# Altium schematic sheet PowerSupply4ClkMezzanine.SchDoc: =ProjectName
size 420 x 297 mm; Author: SBH; CompanyName: WUT; DrawnBy: SBH; Organization: ISE-WUT; Address1: Warsaw Univeristy of Technology; Address2: Nowowiejska 15/19; DocumentNumber: 12; Revision: -; SheetNumber: 12; SheetTotal: 12; EDA_Number: ARTIQ; Projet: eRTM15 Baikal; ModifiedBy: -; CreateDate: XX/XX/XXXX; CheckedDate: -; Title2: PowerSupply4ClkMezzanine.SchDoc; DivGrp: ISE; Designer: SBH; ModifiedDate: -; ProjectName: eRTM15 Baikal
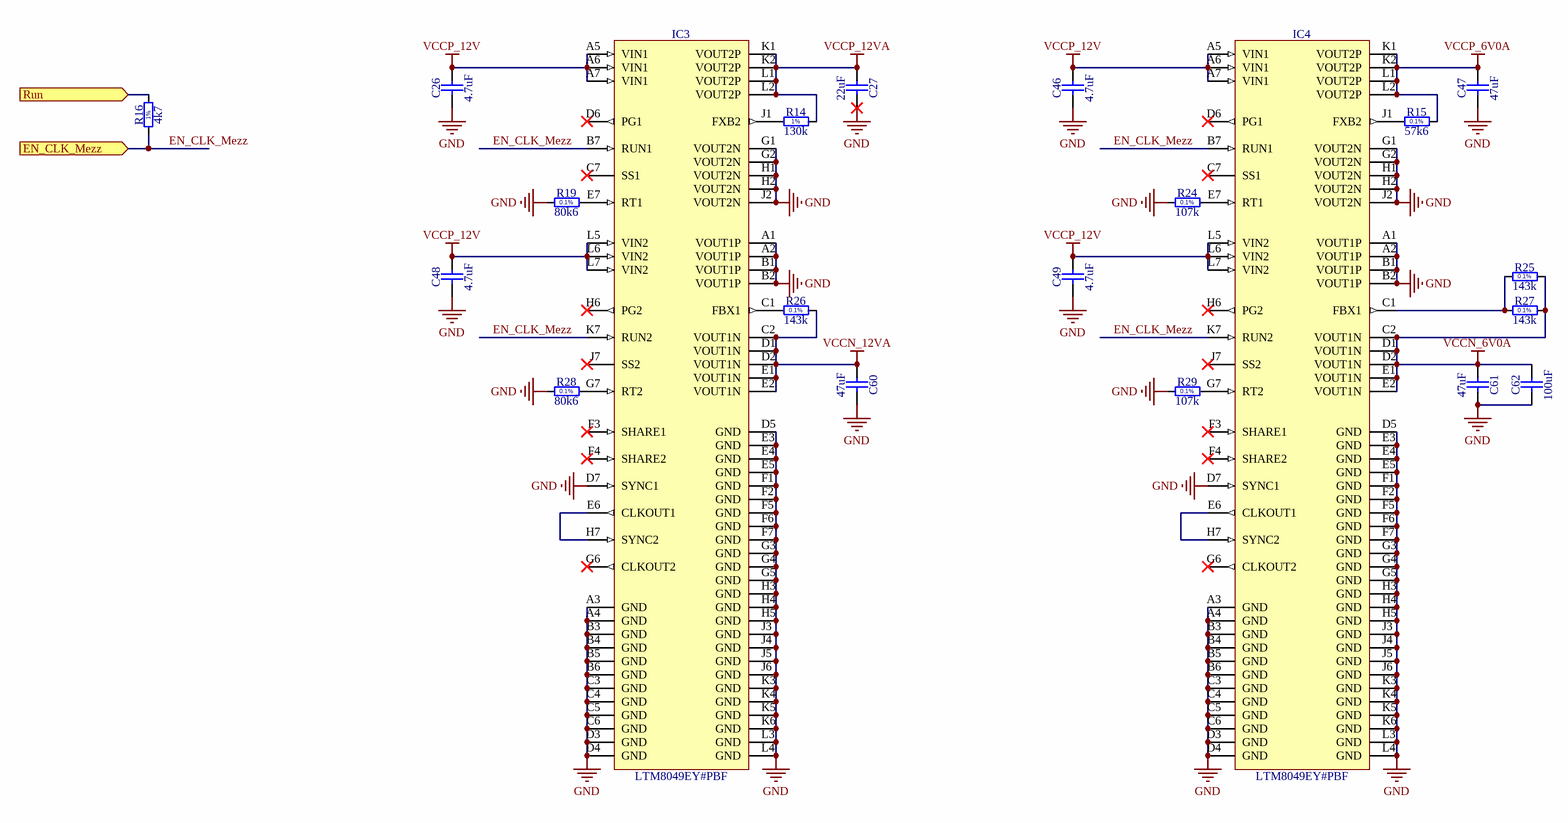
[diagram p0: PowerSupply4ClkMezzanine.SchDoc]

## Parts
C26  4.7uF  [CAPC1709X95N]
C27  22uF  [CAPC3225X270N]
C46  4.7uF  [CAPC1709X95N]
C47  47uF  [CAPC3216X180N]
C48  4.7uF  [CAPC1709X95N]
C49  4.7uF  [CAPC1709X95N]
C60  47uF  [CAPC3216X180N]
C61  47uF  [CAPC3216X180N]
C62  100uF  [CAPC3216X180N]
IC3  LTM8049EY#PBF  [BGA77C127P7X11_900X1500X262]
IC4  LTM8049EY#PBF  [BGA77C127P7X11_900X1500X262]
R14  130k  [RESC1005X40N]
R15  57k6  [RESC1608X55N]
R16  4k7  [RESC1005X40N]
R19  80k6  [RESC1608X55N]
R24  107k  [RESC1608X55N]
R25  143k  [RESC1608X55N]
R26  143k  [RESC1608X55N]
R27  143k  [RESC1608X55N]
R28  80k6  [RESC1608X55N]
R29  107k  [RESC1608X55N]

## Ports
EN_CLK_Mezz (in), Run (in)

## Nets
GND: C26.1 C27.2 C46.1 C47.1 C48.1 C49.1 C60.2 C61.2 C62.1 IC3.A1(VOUT1P) IC3.A2(VOUT1P) IC3.A3(GND) IC3.A4(GND) IC3.B1(VOUT1P) IC3.B2(VOUT1P) IC3.B3(GND) IC3.B4(GND) IC3.B5(GND) IC3.B6(GND) IC3.C3(GND) IC3.C4(GND) IC3.C5(GND) IC3.C6(GND) IC3.D3(GND) IC3.D4(GND) IC3.D5(GND) IC3.D7(SYNC1) IC3.E3(GND) IC3.E4(GND) IC3.E5(GND) IC3.F1(GND) IC3.F2(GND) IC3.F5(GND) IC3.F6(GND) IC3.F7(GND) IC3.G1(VOUT2N) IC3.G2(VOUT2N) IC3.G3(GND) IC3.G4(GND) IC3.G5(GND) IC3.H1(VOUT2N) IC3.H2(VOUT2N) IC3.H3(GND) IC3.H4(GND) IC3.H5(GND) IC3.J2(VOUT2N) IC3.J3(GND) IC3.J4(GND) IC3.J5(GND) IC3.J6(GND) IC3.K3(GND) IC3.K4(GND) IC3.K5(GND) IC3.K6(GND) IC3.L3(GND) IC3.L4(GND) IC4.A1(VOUT1P) IC4.A2(VOUT1P) IC4.A3(GND) IC4.A4(GND) IC4.B1(VOUT1P) IC4.B2(VOUT1P) IC4.B3(GND) IC4.B4(GND) IC4.B5(GND) IC4.B6(GND) IC4.C3(GND) IC4.C4(GND) IC4.C5(GND) IC4.C6(GND) IC4.D3(GND) IC4.D4(GND) IC4.D5(GND) IC4.D7(SYNC1) IC4.E3(GND) IC4.E4(GND) IC4.E5(GND) IC4.F1(GND) IC4.F2(GND) IC4.F5(GND) IC4.F6(GND) IC4.F7(GND) IC4.G1(VOUT2N) IC4.G2(VOUT2N) IC4.G3(GND) IC4.G4(GND) IC4.G5(GND) IC4.H1(VOUT2N) IC4.H2(VOUT2N) IC4.H3(GND) IC4.H4(GND) IC4.H5(GND) IC4.J2(VOUT2N) IC4.J3(GND) IC4.J4(GND) IC4.J5(GND) IC4.J6(GND) IC4.K3(GND) IC4.K4(GND) IC4.K5(GND) IC4.K6(GND) IC4.L3(GND) IC4.L4(GND) R19.1 R24.1 R28.1 R29.1
VCCN_6V0A: C61.1 C62.2 IC4.C2(VOUT1N) IC4.D1(VOUT1N) IC4.D2(VOUT1N) IC4.E1(VOUT1N) IC4.E2(VOUT1N) R25.2 R27.2
VCCN_12VA: C60.1 IC3.C2(VOUT1N) IC3.D1(VOUT1N) IC3.D2(VOUT1N) IC3.E1(VOUT1N) IC3.E2(VOUT1N) R26.2
VCCP_6V0A: C47.2 IC4.K1(VOUT2P) IC4.K2(VOUT2P) IC4.L1(VOUT2P) IC4.L2(VOUT2P) R15.2
VCCP_12V: C26.2 C46.2 C48.2 C49.2 IC3.A5(VIN1) IC3.A6(VIN1) IC3.A7(VIN1) IC3.L5(VIN2) IC3.L6(VIN2) IC3.L7(VIN2) IC4.A5(VIN1) IC4.A6(VIN1) IC4.A7(VIN1) IC4.L5(VIN2) IC4.L6(VIN2) IC4.L7(VIN2)
VCCP_12VA: C27.1 IC3.K1(VOUT2P) IC3.K2(VOUT2P) IC3.L1(VOUT2P) IC3.L2(VOUT2P) R14.2
EN_CLK_Mezz: IC3.B7(RUN1) IC3.K7(RUN2) IC4.B7(RUN1) IC4.K7(RUN2) R16.1 ; port EN_CLK_Mezz
Run: R16.2 ; port Run
NetIC3_C1: IC3.C1(FBX1) R26.1
NetIC3_E6: IC3.E6(CLKOUT1) IC3.H7(SYNC2)
NetIC3_E7: IC3.E7(RT1) R19.2
NetIC3_G7: IC3.G7(RT2) R28.2
NetIC3_J1: IC3.J1(FXB2) R14.1
NetIC4_C1: IC4.C1(FBX1) R25.1 R27.1
NetIC4_E6: IC4.E6(CLKOUT1) IC4.H7(SYNC2)
NetIC4_E7: IC4.E7(RT1) R24.2
NetIC4_G7: IC4.G7(RT2) R29.2
NetIC4_J1: IC4.J1(FXB2) R15.1

Not connected (* = marked no-connect by the designer): IC3 C7(SS1)* D6(PG1)* F3(SHARE1)* F4(SHARE2)* G6(CLKOUT2)* H6(PG2)* J7(SS2)*; IC4 C7(SS1)* D6(PG1)* F3(SHARE1)* F4(SHARE2)* G6(CLKOUT2)* H6(PG2)* J7(SS2)*

## Notes on the sheet
- Project/Equipment
- Document
- Designer
- Drawn by
- Check.by
- File
- Last Mod.
- Print Date
- Sheet
- Size
- A3
- of
- Rev
- (in symbol R0402_4K7_1%_0.0625W_100PPM) 1%
- (in symbol R0402_130K_1%_0.0625W_100PPM) 1%
- (in symbol R0603_57K6_0.1%_0.063W_10PPM) 0.1%
- (in symbol R0603_80K6_0.1%_0.063W_10PPM) 0.1%
- (in symbol R0603_107K_0.1%_0.063W_10PPM) 0.1%
- (in symbol R0603_143K_0.1%_0.063W_10PPM) 0.1%

## Library data of the parts
C26 C46 C48 C49 = CC0603_4.7UF_16V_10%_X5R: Non-polarised capacitor; Part Description: SMD Multilayer Chip Ceramic Capacitor; Manufacturer: GENERIC; Manufacturer1 Part Number: EMK107ABJ475KA-T; Voltage: 16V; TC: X5R; Tolerance: ±10%; Part Number: CC0603_4.7UF_16V_10%_X5R; Component Kind: Standard; Component Type: Standard; Pin Count: 2; Value: 4.7uF; Status: None; Manufacturer Part Number: CC0603_4.7UF_16V_10%_X5R; Case: 0603; Mounted: Yes; Socket: No; SMD: Yes; Sense: No; Manufacturer1 Example: TAIYO YUDEN; Manufacturer1 ComponentHeight: 0.95mm; HelpURL: \\cern.ch\dfs\Applications\Altium\Datasheets\CC0603_X7R_TAIYO-YUDEN_HIGH-VALUE.pdf; Author: CERN DEM JLC; CreateDate: 2013-12-16; LatestRevisionDate: 2014-09-16
C27 = CC1210_22UF_25V_10%_X5R: Non-polarised capacitor; Part Description: SMD Multilayer Chip Ceramic Capacitor; Manufacturer: GENERIC; Manufacturer1 Part Number: 12103D226KAT2A; Voltage: 25V; TC: X5R; Tolerance: ±10%; Part Number: CC1210_22UF_25V_10%_X5R; Component Kind: Standard; Component Type: Standard; Pin Count: 2; Value: 22uF; Status: Preferred; Manufacturer Part Number: CC1210_22UF_25V_10%_X5R; Case: 1210; Mounted: Yes; Socket: No; SMD: Yes; Sense: No; Manufacturer1 Example: AVX; Manufacturer1 ComponentHeight: 2.79mm; HelpURL: \\cern.ch\dfs\Applications\Altium\Datasheets\CC1210_X5R_AVX.pdf; Author: CERN DEM JLC; CreateDate: 2014-11-12; LatestRevisionDate: 2014-11-12
C47 C60 C61 = CC1206_47UF_25V_20%_X5R: Non-polarised capacitor; Part Description: SMD Multilayer Chip Ceramic Capacitor; Manufacturer: TDK; Manufacturer Part Number: C3216X5R1E476M160AC; Voltage: 25V; TC: X5R; Tolerance: ±20%; Part Number: CC1206_47UF_25V_20%_X5R; Component Kind: Standard; Component Type: Standard; Pin Count: 2; Value: 47uF; Status: None; Case: 1206; Mounted: Yes; Socket: No; SMD: Yes; Sense: No; ComponentHeight: 1.8mm; HelpURL: \\cern.ch\dfs\Applications\Altium\Datasheets\CC1206_X5R_TDK_C.pdf; Author: CERN DEM JLC; CreateDate: 2013-11-20; LatestRevisionDate: 2013-11-20
C62 = CC1206_100UF_6.3V_20%_X5R: Non-polarised capacitor; Part Description: SMD Multilayer Chip Ceramic Capacitor; Manufacturer: GENERIC; Manufacturer1 Part Number: C1206C107M9PACTU; Voltage: 6.3V; TC: X5R; Tolerance: ±10%; Part Number: CC1206_100UF_6.3V_20%_X5R; Component Kind: Standard; Component Type: Standard; Pin Count: 2; Value: 100uF; Status: None; Manufacturer Part Number: CC1206_100UF_6.3V_20%_X5R; Case: 1206; Mounted: Yes; Socket: No; SMD: Yes; Sense: No; Manufacturer1 Example: KEMET; Manufacturer1 ComponentHeight: 1.8mm; HelpURL: \\cern.ch\dfs\Applications\Altium\Datasheets\CC1206_X5R_KEMET.pdf; Author: CERN DEM JLC; CreateDate: 2012-09-26; LatestRevisionDate: 2012-09-26
IC3 IC4 = LTM8049EY#PBF: Dual SEPIC or Inverting uModule DC/DC Converter; Manufacturer: LINEAR TECHNOLOGY; PressFit: No; Bonding: No; Part Number: LTM8049EY#PBF; Component Kind: Standard; Component Type: Standard; Device: LTM8049EY#PBF; PackageDescription: BGA, 1.27mm Pitch, Rect.; 77 Pin, 7 Columns X 11 Rows, 9.00mm X 15.00mm X 2.62mm H; Part Description: Dual SEPIC or Inverting uModule DC/DC Converter; Manufacturer Part Number: LTM8049EY#PBF; Pin Count: 77; Case: BGA77; Mounted: Yes; Socket: No; SMD: Yes; Sense: No; ComponentHeight: 2.62mm; HelpURL: \\cern.ch\dfs\Applications\Altium\Datasheets\LTM8049EY#PBF.pdf; Author: CERN DEM JLC; CreateDate: 2016-12-08; LatestRevisionDate: 2016-12-08
R14 = R0402_130K_1%_0.0625W_100PPM: Resistor - 1%; Part Description: General Purpose Thick Film Chip Resistor; Manufacturer: GENERIC; Manufacturer1 Part Number: 232270671304L; TC: ±100ppm/°C; Part Number: R0402_130K_1%_0.0625W_100PPM; Component Kind: Standard; Component Type: Standard; Pin Count: 2; Value: 130k; Status: Not recommended; Power: 0.0625W; Tolerance: ±1%; Manufacturer Part Number: R0402_130K_1%_0.0625W_100PPM; Case: 0402; Mounted: Yes; Sense: No; Socket: No; SMD: Yes; Manufacturer1 Example: YAGEO PHYCOMP; Manufacturer1 ComponentHeight: 0.4mm; HelpURL: \\cern.ch\dfs\Applications\Altium\Datasheets\R0402_Phycomp_RC0402.pdf; Author: CERN DEM JLC; CreateDate: 2007-12-03; LatestRevisionDate: 2012-10-17
R15 = R0603_57K6_0.1%_0.063W_10PPM: Resistor - 0.1%; Part Description: Thin Film Chip Resistor; Manufacturer: GENERIC; Manufacturer1 Part Number: RN73C1J57K6BTDF; Power: 0.063W; TC: ±10ppm; Part Number: R0603_57K6_0.1%_0.063W_10PPM; Component Kind: Standard; Component Type: Standard; Pin Count: 2; Value: 57k6; Status: Not recommended; Tolerance: ±0.1%; Manufacturer Part Number: R0603_57K6_0.1%_0.063W_10PPM; Case: 0603; Mounted: Yes; Sense: No; Socket: No; SMD: Yes; Manufacturer1 Example: TYCO HOLSWORTHY; Manufacturer1 ComponentHeight: 0.5mm; HelpURL: \\cern.ch\dfs\Applications\Altium\Datasheets\R0603_Tyco_RN73.pdf; Author: CERN DEM JLC; CreateDate: 2007-12-03; LatestRevisionDate: 2008-03-13
R16 = R0402_4K7_1%_0.0625W_100PPM: Resistor - 1%; Part Description: General Purpose Thick Film Chip Resistor; Manufacturer: GENERIC; Manufacturer1 Part Number: 232270674702L; TC: ±100ppm/°C; Part Number: R0402_4K7_1%_0.0625W_100PPM; Component Kind: Standard; Component Type: Standard; Pin Count: 2; Value: 4k7; Status: Not recommended; Power: 0.0625W; Tolerance: ±1%; Manufacturer Part Number: R0402_4K7_1%_0.0625W_100PPM; Case: 0402; Mounted: Yes; Sense: No; Socket: No; SMD: Yes; Manufacturer1 Example: YAGEO PHYCOMP; Manufacturer1 ComponentHeight: 0.4mm; HelpURL: \\cern.ch\dfs\Applications\Altium\Datasheets\R0402_Phycomp_RC0402.pdf; Author: CERN DEM JLC; CreateDate: 2007-12-03; LatestRevisionDate: 2012-10-17
R19 R28 = R0603_80K6_0.1%_0.063W_10PPM: Resistor - 0.1%; Part Description: Thin Film Chip Resistor; Manufacturer: GENERIC; Manufacturer1 Part Number: RN73C1J80K6BTDF; Power: 0.063W; TC: ±10ppm; Part Number: R0603_80K6_0.1%_0.063W_10PPM; Component Kind: Standard; Component Type: Standard; Pin Count: 2; Value: 80k6; Status: Not recommended; Tolerance: ±0.1%; Manufacturer Part Number: R0603_80K6_0.1%_0.063W_10PPM; Case: 0603; Mounted: Yes; Sense: No; Socket: No; SMD: Yes; Manufacturer1 Example: TYCO HOLSWORTHY; Manufacturer1 ComponentHeight: 0.5mm; HelpURL: \\cern.ch\dfs\Applications\Altium\Datasheets\R0603_Tyco_RN73.pdf; Author: CERN DEM JLC; CreateDate: 2007-12-03; LatestRevisionDate: 2008-03-13
R24 R29 = R0603_107K_0.1%_0.063W_10PPM: Resistor - 0.1%; Part Description: Thin Film Chip Resistor; Manufacturer: GENERIC; Manufacturer1 Part Number: RN73C1J107KBTDF; Power: 0.063W; TC: ±10ppm; Part Number: R0603_107K_0.1%_0.063W_10PPM; Component Kind: Standard; Component Type: Standard; Pin Count: 2; Value: 107k; Status: Not recommended; Tolerance: ±0.1%; Manufacturer Part Number: R0603_107K_0.1%_0.063W_10PPM; Case: 0603; Mounted: Yes; Sense: No; Socket: No; SMD: Yes; Manufacturer1 Example: TYCO HOLSWORTHY; Manufacturer1 ComponentHeight: 0.5mm; HelpURL: \\cern.ch\dfs\Applications\Altium\Datasheets\R0603_Tyco_RN73.pdf; Author: CERN DEM JLC; CreateDate: 2007-12-03; LatestRevisionDate: 2008-03-13
R25-R27 = R0603_143K_0.1%_0.063W_10PPM: Resistor - 0.1%; Part Description: Thin Film Chip Resistor; Manufacturer: GENERIC; Manufacturer1 Part Number: RN73C1J143KBTDF; Power: 0.063W; TC: ±10ppm; Part Number: R0603_143K_0.1%_0.063W_10PPM; Component Kind: Standard; Component Type: Standard; Pin Count: 2; Value: 143k; Status: Not recommended; Tolerance: ±0.1%; Manufacturer Part Number: R0603_143K_0.1%_0.063W_10PPM; Case: 0603; Mounted: Yes; Sense: No; Socket: No; SMD: Yes; Manufacturer1 Example: TYCO HOLSWORTHY; Manufacturer1 ComponentHeight: 0.5mm; HelpURL: \\cern.ch\dfs\Applications\Altium\Datasheets\R0603_Tyco_RN73.pdf; Author: CERN DEM JLC; CreateDate: 2007-12-03; LatestRevisionDate: 2008-03-13